# Altium project higgs.PrjPCB (part 7 of 7)
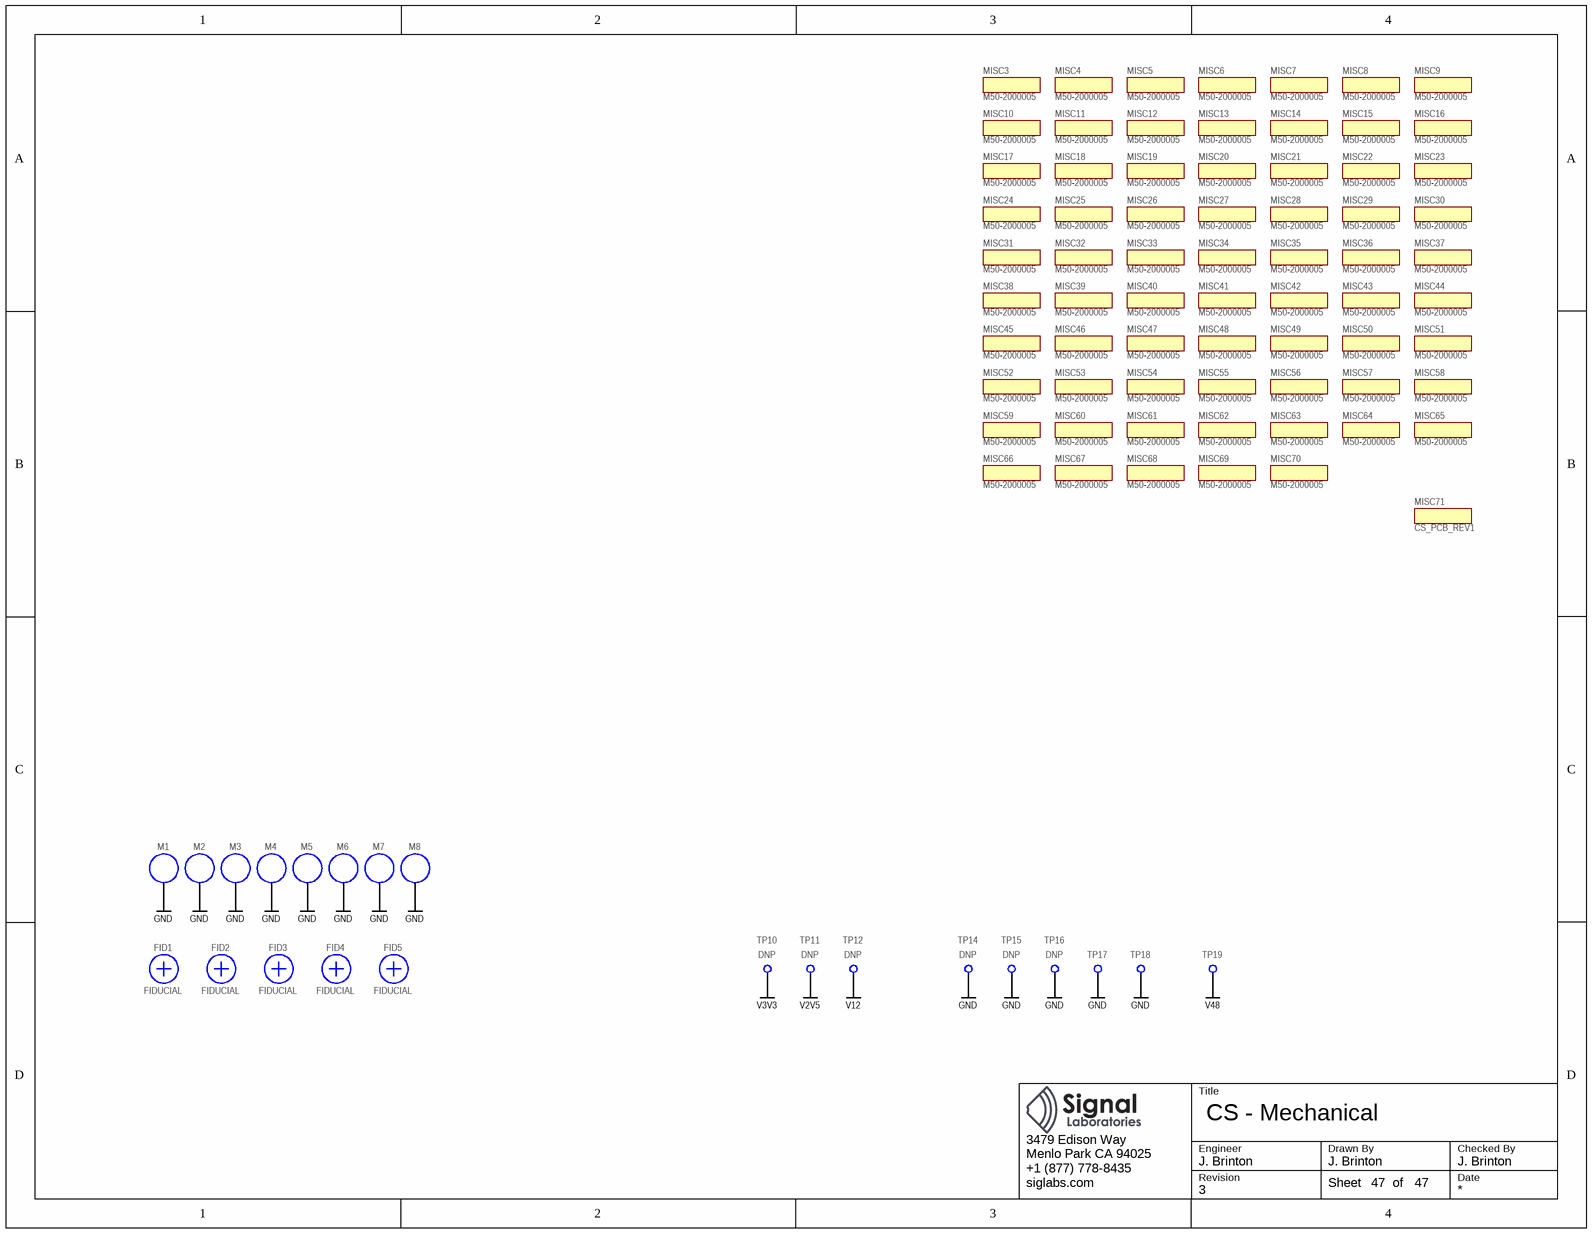
[diagram p49: mechanical.SchDoc]

## Nets that join several sheets
GND: main (R30.1 R124.1), MAIN/ARRAY/FPGA30 (46 pins), MAIN/ARRAY/FPGA30/FPGAGND (226 pins), MAIN/ARRAY/FPGA30/FPGASERDES (41 pins), MAIN/ARRAY/FPGA30/FPGAPOWER (34 pins), MAIN/ARRAY/FPGA31 (46 pins), MAIN/ARRAY/FPGA31/FPGAGND (226 pins), MAIN/ARRAY/FPGA31/FPGASERDES (41 pins), MAIN/ARRAY/FPGA31/FPGAPOWER (34 pins), MAIN/ARRAY/FPGA32 (46 pins), MAIN/ARRAY/FPGA32/FPGAGND (226 pins), MAIN/ARRAY/FPGA32/FPGASERDES (41 pins), MAIN/ARRAY/FPGA32/FPGAPOWER (34 pins), MAIN/ARRAY/FPGA33 (46 pins), MAIN/ARRAY/FPGA33/FPGAGND (226 pins), MAIN/ARRAY/FPGA33/FPGASERDES (41 pins), MAIN/ARRAY/FPGA33/FPGAPOWER (34 pins), MAIN/ARRAY/FPGA20 (46 pins), MAIN/ARRAY/FPGA20/FPGAGND (226 pins), MAIN/ARRAY/FPGA20/FPGASERDES (41 pins), MAIN/ARRAY/FPGA20/FPGAPOWER (34 pins), MAIN/ARRAY/FPGA21 (46 pins), MAIN/ARRAY/FPGA21/FPGAGND (226 pins), MAIN/ARRAY/FPGA21/FPGASERDES (41 pins), MAIN/ARRAY/FPGA21/FPGAPOWER (34 pins), MAIN/ARRAY/FPGA22 (46 pins), MAIN/ARRAY/FPGA22/FPGAGND (226 pins), MAIN/ARRAY/FPGA22/FPGASERDES (41 pins), MAIN/ARRAY/FPGA22/FPGAPOWER (34 pins), MAIN/ARRAY/FPGA23 (46 pins), MAIN/ARRAY/FPGA23/FPGAGND (226 pins), MAIN/ARRAY/FPGA23/FPGASERDES (41 pins), MAIN/ARRAY/FPGA23/FPGAPOWER (34 pins), MAIN/ARRAY/SDRAM33 (7 pins), MAIN/ARRAY/SDRAM33/SDRAMU (38 pins), MAIN/ARRAY/SDRAM33/SDRAML (38 pins), MAIN/ARRAY/SDRAM32 (7 pins), MAIN/ARRAY/SDRAM32/SDRAMU (38 pins), MAIN/ARRAY/SDRAM32/SDRAML (38 pins), MAIN/ARRAY/SDRAM31 (7 pins), MAIN/ARRAY/SDRAM31/SDRAMU (38 pins), MAIN/ARRAY/SDRAM31/SDRAML (38 pins), MAIN/ARRAY/SDRAM30 (7 pins), MAIN/ARRAY/SDRAM30/SDRAMU (38 pins), MAIN/ARRAY/SDRAM30/SDRAML (38 pins), clock (45 pins), reset (8 pins), power-v3v3 (15 pins), power-v1v35 (13 pins), power-vtt (12 pins), power-v5 (9 pins), power-v2v5 (19 pins), som (84 pins), con-som (43 pins), cellular (66 pins), radio-power (38 pins), radio-rf (5 pins), tx (30 pins), MAIN/U_radio/U_radio-rf/TX/U_pa-2g (15 pins), MAIN/U_radio/U_radio-rf/TX/U_pa-5g (15 pins), MAIN/U_radio/U_radio-rf/TX/U_pa-2g (15 pins), MAIN/U_radio/U_radio-rf/TX/U_pa-5g (15 pins), rx (24 pins), mechanical (13 pins)
V1V35: main (NT5.A), reset (R57.2), power-v1v35 (R34.2), power-vtt (C77.2 C78.2 R31.1 U8.2)
V2V5: MAIN/ARRAY/FPGA30/FPGAPOWER (12 pins), MAIN/ARRAY/FPGA31/FPGAPOWER (12 pins), MAIN/ARRAY/FPGA32/FPGAPOWER (12 pins), MAIN/ARRAY/FPGA33/FPGAPOWER (12 pins), MAIN/ARRAY/FPGA20/FPGAPOWER (12 pins), MAIN/ARRAY/FPGA21/FPGAPOWER (12 pins), MAIN/ARRAY/FPGA22/FPGAPOWER (12 pins), MAIN/ARRAY/FPGA23/FPGAPOWER (12 pins), power-v2v5 (5 pins), mechanical (TP11.1)
V3V3: main (R29.2 R123.2), MAIN/ARRAY/FPGA30 (9 pins), MAIN/ARRAY/FPGA30/FPGAPOWER (5 pins), MAIN/ARRAY/FPGA31 (9 pins), MAIN/ARRAY/FPGA31/FPGAPOWER (5 pins), MAIN/ARRAY/FPGA32 (9 pins), MAIN/ARRAY/FPGA32/FPGAPOWER (5 pins), MAIN/ARRAY/FPGA33 (9 pins), MAIN/ARRAY/FPGA33/FPGAPOWER (5 pins), MAIN/ARRAY/FPGA20 (9 pins), MAIN/ARRAY/FPGA20/FPGAPOWER (5 pins), MAIN/ARRAY/FPGA21 (9 pins), MAIN/ARRAY/FPGA21/FPGAPOWER (5 pins), MAIN/ARRAY/FPGA22 (9 pins), MAIN/ARRAY/FPGA22/FPGAPOWER (5 pins), MAIN/ARRAY/FPGA23 (9 pins), MAIN/ARRAY/FPGA23/FPGAPOWER (5 pins), clock (L2.2 L3.2 U3.9), reset (C131.1 R56.2 R58.2 U15.6), power-v3v3 (6 pins), power-v1v35 (C84.2 U9.3 U9.6 U9.7), power-vtt (C83.2 U8.7 U8.10), power-v5 (C158.2 U21.3 U21.6 U21.7), power-v2v5 (C161.2 U23.3 U23.6 U23.7), con-som (R1000.2 R1001.2 U1000.5), cellular (13 pins), tx (C192.2 C193.2 U19.1 U20.1), mechanical (TP10.1)
V5: main (F4.1), power-v3v3 (R46.2), power-vtt (R33.2), power-v5 (R109.2 U21.1), power-v2v5 (R115.2), som (20 pins), con-som (8 pins), cellular (U1004.1 U1004.3 U1004.4), MAIN/U_radio/U_radio-rf/TX/U_pa-2g (7 pins), MAIN/U_radio/U_radio-rf/TX/U_pa-5g (8 pins), MAIN/U_radio/U_radio-rf/TX/U_pa-2g (7 pins), MAIN/U_radio/U_radio-rf/TX/U_pa-5g (8 pins)
V12: MAIN/ARRAY/FPGA30/FPGAPOWER (C9A.2 U7A.10 U7A.11 U7A.12), MAIN/ARRAY/FPGA31/FPGAPOWER (C9B.2 U7B.10 U7B.11 U7B.12), MAIN/ARRAY/FPGA32/FPGAPOWER (C9C.2 U7C.10 U7C.11 U7C.12), MAIN/ARRAY/FPGA33/FPGAPOWER (C9D.2 U7D.10 U7D.11 U7D.12), MAIN/ARRAY/FPGA20/FPGAPOWER (C9E.2 U7E.10 U7E.11 U7E.12), MAIN/ARRAY/FPGA21/FPGAPOWER (C9F.2 U7F.10 U7F.11 U7F.12), MAIN/ARRAY/FPGA22/FPGAPOWER (C9G.2 U7G.10 U7G.11 U7G.12), MAIN/ARRAY/FPGA23/FPGAPOWER (C9H.2 U7H.10 U7H.11 U7H.12), power-v3v3 (5 pins), power-v1v35 (10 pins), power-v5 (C160.2 U22.2 U22.3), power-v2v5 (5 pins), mechanical (TP12.1)
VCC3P3_SYS: som (U1003.PAK17 U1003.PAK18 U1003.PAL17 U1003.PAL18), con-som (5 pins)
A.VIOLR_FPGA20: MAIN/ARRAY/FPGA20 (C54E.2 C55E.2 C56E.2 C57E.2), MAIN/ARRAY/FPGA20/FPGA2B (U1E#3.M23 U1E#3.P23 U1E#3.R23 U1E#3.T23)
A.VIOLR_FPGA20: MAIN/ARRAY/FPGA20 (C22E.2 C23E.2 C24E.2 C25E.2), MAIN/ARRAY/FPGA20/FPGA3B (U1E#4.AA23 U1E#4.U23 U1E#4.V23 U1E#4.W23)
A.VIOLR_FPGA21: MAIN/ARRAY/FPGA21 (C54F.2 C55F.2 C56F.2 C57F.2), MAIN/ARRAY/FPGA21/FPGA2B (U1F#3.M23 U1F#3.P23 U1F#3.R23 U1F#3.T23)
A.VIOLR_FPGA21: MAIN/ARRAY/FPGA21 (C22F.2 C23F.2 C24F.2 C25F.2), MAIN/ARRAY/FPGA21/FPGA3B (U1F#4.AA23 U1F#4.U23 U1F#4.V23 U1F#4.W23)
A.VIOLR_FPGA22: MAIN/ARRAY/FPGA22 (C54G.2 C55G.2 C56G.2 C57G.2), MAIN/ARRAY/FPGA22/FPGA2B (U1G#3.M23 U1G#3.P23 U1G#3.R23 U1G#3.T23)
A.VIOLR_FPGA22: MAIN/ARRAY/FPGA22 (C22G.2 C23G.2 C24G.2 C25G.2), MAIN/ARRAY/FPGA22/FPGA3B (U1G#4.AA23 U1G#4.U23 U1G#4.V23 U1G#4.W23)
A.VIOLR_FPGA23: MAIN/ARRAY/FPGA23 (C22H.2 C23H.2 C24H.2 C25H.2), MAIN/ARRAY/FPGA23/FPGA3B (U1H#4.AA23 U1H#4.U23 U1H#4.V23 U1H#4.W23)
A.VIOLR_FPGA30: MAIN/ARRAY/FPGA30 (C54A.2 C55A.2 C56A.2 C57A.2), MAIN/ARRAY/FPGA30/FPGA2B (U1A#3.M23 U1A#3.P23 U1A#3.R23 U1A#3.T23)
A.VIOLR_FPGA31: MAIN/ARRAY/FPGA31 (C54B.2 C55B.2 C56B.2 C57B.2), MAIN/ARRAY/FPGA31/FPGA2B (U1B#3.M23 U1B#3.P23 U1B#3.R23 U1B#3.T23)
A.VIOLR_FPGA32: MAIN/ARRAY/FPGA32 (C54C.2 C55C.2 C56C.2 C57C.2), MAIN/ARRAY/FPGA32/FPGA2B (U1C#3.M23 U1C#3.P23 U1C#3.R23 U1C#3.T23)
A.VIOTB_FPGA20: MAIN/ARRAY/FPGA20 (C50E.2 C51E.2 C52E.2 C53E.2), MAIN/ARRAY/FPGA20/FPGA1B (U1E#2.K17 U1E#2.K18 U1E#2.K19 U1E#2.K21)
A.VIOTB_FPGA20: MAIN/ARRAY/FPGA20 (C28E.2 C29E.2 C30E.2), MAIN/ARRAY/FPGA20/FPGA4B (U1E#5.AB23 U1E#5.AC23)
A.VIOTB_FPGA21: MAIN/ARRAY/FPGA21 (C50F.2 C51F.2 C52F.2 C53F.2), MAIN/ARRAY/FPGA21/FPGA1B (U1F#2.K17 U1F#2.K18 U1F#2.K19 U1F#2.K21)
A.VIOTB_FPGA21: MAIN/ARRAY/FPGA21 (C28F.2 C29F.2 C30F.2), MAIN/ARRAY/FPGA21/FPGA4B (U1F#5.AB23 U1F#5.AC23)
A.VIOTB_FPGA22: MAIN/ARRAY/FPGA22 (C50G.2 C51G.2 C52G.2 C53G.2), MAIN/ARRAY/FPGA22/FPGA1B (U1G#2.K17 U1G#2.K18 U1G#2.K19 U1G#2.K21)
A.VIOTB_FPGA22: MAIN/ARRAY/FPGA22 (C28G.2 C29G.2 C30G.2), MAIN/ARRAY/FPGA22/FPGA4B (U1G#5.AB23 U1G#5.AC23)
A.VIOTB_FPGA23: MAIN/ARRAY/FPGA23 (C28H.2 C29H.2 C30H.2), MAIN/ARRAY/FPGA23/FPGA4B (U1H#5.AB23 U1H#5.AC23)
A.VIOTB_FPGA30: MAIN/ARRAY/FPGA30 (C50A.2 C51A.2 C52A.2 C53A.2), MAIN/ARRAY/FPGA30/FPGA1B (U1A#2.K17 U1A#2.K18 U1A#2.K19 U1A#2.K21)
A.VIOTB_FPGA31: MAIN/ARRAY/FPGA31 (C50B.2 C51B.2 C52B.2 C53B.2), MAIN/ARRAY/FPGA31/FPGA1B (U1B#2.K17 U1B#2.K18 U1B#2.K19 U1B#2.K21)
A.VIOTB_FPGA32: MAIN/ARRAY/FPGA32 (C50C.2 C51C.2 C52C.2 C53C.2), MAIN/ARRAY/FPGA32/FPGA1B (U1C#2.K17 U1C#2.K18 U1C#2.K19 U1C#2.K21)
B.VIOLR_FPGA21: MAIN/ARRAY/FPGA21 (C33F.2 C34F.2 C35F.2 C36F.2), MAIN/ARRAY/FPGA21/FPGA6B (U1F#6.AA10 U1F#6.U10 U1F#6.V10 U1F#6.W10)
B.VIOLR_FPGA22: MAIN/ARRAY/FPGA22 (C33G.2 C34G.2 C35G.2 C36G.2), MAIN/ARRAY/FPGA22/FPGA6B (U1G#6.AA10 U1G#6.U10 U1G#6.V10 U1G#6.W10)
B.VIOLR_FPGA23: MAIN/ARRAY/FPGA23 (C33H.2 C34H.2 C35H.2 C36H.2), MAIN/ARRAY/FPGA23/FPGA6B (U1H#6.AA10 U1H#6.U10 U1H#6.V10 U1H#6.W10)
B.VIOLR_FPGA30: MAIN/ARRAY/FPGA30 (C15A.2 C16A.2 C17A.2 C18A.2), MAIN/ARRAY/FPGA30/FPGA7B (U1A#7.M10 U1A#7.P10 U1A#7.R10 U1A#7.T10)
B.VIOLR_FPGA31: MAIN/ARRAY/FPGA31 (C33B.2 C34B.2 C35B.2 C36B.2), MAIN/ARRAY/FPGA31/FPGA6B (U1B#6.AA10 U1B#6.U10 U1B#6.V10 U1B#6.W10)
B.VIOLR_FPGA31: MAIN/ARRAY/FPGA31 (C15B.2 C16B.2 C17B.2 C18B.2), MAIN/ARRAY/FPGA31/FPGA7B (U1B#7.M10 U1B#7.P10 U1B#7.R10 U1B#7.T10)
B.VIOLR_FPGA32: MAIN/ARRAY/FPGA32 (C33C.2 C34C.2 C35C.2 C36C.2), MAIN/ARRAY/FPGA32/FPGA6B (U1C#6.AA10 U1C#6.U10 U1C#6.V10 U1C#6.W10)
B.VIOLR_FPGA32: MAIN/ARRAY/FPGA32 (C15C.2 C16C.2 C17C.2 C18C.2), MAIN/ARRAY/FPGA32/FPGA7B (U1C#7.M10 U1C#7.P10 U1C#7.R10 U1C#7.T10)
B.VIOLR_FPGA33: MAIN/ARRAY/FPGA33 (C33D.2 C34D.2 C35D.2 C36D.2), MAIN/ARRAY/FPGA33/FPGA6B (U1D#6.AA10 U1D#6.U10 U1D#6.V10 U1D#6.W10)
B.VIOLR_FPGA33: MAIN/ARRAY/FPGA33 (C15D.2 C16D.2 C17D.2 C18D.2), MAIN/ARRAY/FPGA33/FPGA7B (U1D#7.M10 U1D#7.P10 U1D#7.R10 U1D#7.T10)
B.VIOTB_FPGA21: MAIN/ARRAY/FPGA21 (C31F.2 C32F.2 R4F.2 U6F.13), MAIN/ARRAY/FPGA21/FPGA8B (R1F.2 U1F#8.AB10 U1F#8.AC10)
B.VIOTB_FPGA22: MAIN/ARRAY/FPGA22 (C31G.2 C32G.2 R4G.2 U6G.13), MAIN/ARRAY/FPGA22/FPGA8B (R1G.2 U1G#8.AB10 U1G#8.AC10)
B.VIOTB_FPGA23: MAIN/ARRAY/FPGA23 (C31H.2 C32H.2 R4H.2 U6H.13), MAIN/ARRAY/FPGA23/FPGA8B (R1H.2 U1H#8.AB10 U1H#8.AC10)
B.VIOTB_FPGA30: MAIN/ARRAY/FPGA30 (C46A.2 C47A.2 C48A.2 C49A.2), MAIN/ARRAY/FPGA30/FPGA0B (U1A#1.K12 U1A#1.K14 U1A#1.K15 U1A#1.K16)
B.VIOTB_FPGA31: MAIN/ARRAY/FPGA31 (C31B.2 C32B.2 R4B.2 U6B.13), MAIN/ARRAY/FPGA31/FPGA8B (R1B.2 U1B#8.AB10 U1B#8.AC10)
B.VIOTB_FPGA31: MAIN/ARRAY/FPGA31 (C46B.2 C47B.2 C48B.2 C49B.2), MAIN/ARRAY/FPGA31/FPGA0B (U1B#1.K12 U1B#1.K14 U1B#1.K15 U1B#1.K16)
B.VIOTB_FPGA32: MAIN/ARRAY/FPGA32 (C31C.2 C32C.2 R4C.2 U6C.13), MAIN/ARRAY/FPGA32/FPGA8B (R1C.2 U1C#8.AB10 U1C#8.AC10)
B.VIOTB_FPGA32: MAIN/ARRAY/FPGA32 (C46C.2 C47C.2 C48C.2 C49C.2), MAIN/ARRAY/FPGA32/FPGA0B (U1C#1.K12 U1C#1.K14 U1C#1.K15 U1C#1.K16)
B.VIOTB_FPGA33: MAIN/ARRAY/FPGA33 (C31D.2 C32D.2 R4D.2 U6D.13), MAIN/ARRAY/FPGA33/FPGA8B (R1D.2 U1D#8.AB10 U1D#8.AC10)
B.VIOTB_FPGA33: MAIN/ARRAY/FPGA33 (C46D.2 C47D.2 C48D.2 C49D.2), MAIN/ARRAY/FPGA33/FPGA0B (U1D#1.K12 U1D#1.K14 U1D#1.K15 U1D#1.K16)
CLK.C_N: MAIN/ARRAY/FPGA30 (C7A.2), clock (R13.4 U3.52)
CLK.C_N: MAIN/ARRAY/FPGA31 (C7B.2), clock (R13.2 U3.54)
CLK.C_N: MAIN/ARRAY/FPGA32 (C7C.2), clock (R12.8 U3.56)
CLK.C_N: MAIN/ARRAY/FPGA33 (C7D.2), clock (R13.8 U3.46)
CLK.C_N: MAIN/ARRAY/FPGA20 (C7E.2), clock (R12.6 U3.59)
CLK.C_N: MAIN/ARRAY/FPGA21 (C7F.2), clock (R12.4 U3.42 U3.61)
CLK.C_N: MAIN/ARRAY/FPGA22 (C7G.2), clock (R12.2 U3.38 U3.63)
CLK.C_N: MAIN/ARRAY/FPGA23 (C7H.2), clock (R16.2 U3.36 U3.44)
CLK.C_P: MAIN/ARRAY/FPGA30 (C6A.2), clock (R13.3 U3.53)
CLK.C_P: MAIN/ARRAY/FPGA31 (C6B.2), clock (R13.1 U3.55)
CLK.C_P: MAIN/ARRAY/FPGA32 (C6C.2), clock (R12.7 U3.57)
CLK.C_P: MAIN/ARRAY/FPGA33 (C6D.2), clock (R13.7 U3.47)
CLK.C_P: MAIN/ARRAY/FPGA20 (C6E.2), clock (R12.5 U3.60)
CLK.C_P: MAIN/ARRAY/FPGA21 (C6F.2), clock (R12.3 U3.43 U3.62)
CLK.C_P: MAIN/ARRAY/FPGA22 (C6G.2), clock (R12.1 U3.39 U3.64)
CLK.C_P: MAIN/ARRAY/FPGA23 (C6H.2), clock (R16.1 U3.37 U3.45)
DA/C.CTRL.CASN: MAIN/ARRAY/SDRAM33/SDRAMU (U14A.K3), MAIN/ARRAY/SDRAM33/SDRAML (U14B.K3)
DA/C.CTRL.CASN: MAIN/ARRAY/SDRAM32/SDRAMU (U14C.K3), MAIN/ARRAY/SDRAM32/SDRAML (U14D.K3)
DA/C.CTRL.CASN: MAIN/ARRAY/SDRAM31/SDRAMU (U14E.K3), MAIN/ARRAY/SDRAM31/SDRAML (U14F.K3)
DA/C.CTRL.CASN: MAIN/ARRAY/SDRAM30/SDRAMU (U14G.K3), MAIN/ARRAY/SDRAM30/SDRAML (U14H.K3)
DA/C.CTRL.CKE: MAIN/ARRAY/SDRAM33/SDRAMU (U14A.K9), MAIN/ARRAY/SDRAM33/SDRAML (U14B.K9)
DA/C.CTRL.CKE: MAIN/ARRAY/SDRAM32/SDRAMU (U14C.K9), MAIN/ARRAY/SDRAM32/SDRAML (U14D.K9)
DA/C.CTRL.CKE: MAIN/ARRAY/SDRAM31/SDRAMU (U14E.K9), MAIN/ARRAY/SDRAM31/SDRAML (U14F.K9)
DA/C.CTRL.CKE: MAIN/ARRAY/SDRAM30/SDRAMU (U14G.K9), MAIN/ARRAY/SDRAM30/SDRAML (U14H.K9)
DA/C.CTRL.CLK_N: MAIN/ARRAY/SDRAM33/SDRAMU (U14A.K7), MAIN/ARRAY/SDRAM33/SDRAML (U14B.K7)
DA/C.CTRL.CLK_N: MAIN/ARRAY/SDRAM32/SDRAMU (U14C.K7), MAIN/ARRAY/SDRAM32/SDRAML (U14D.K7)
DA/C.CTRL.CLK_N: MAIN/ARRAY/SDRAM31/SDRAMU (U14E.K7), MAIN/ARRAY/SDRAM31/SDRAML (U14F.K7)
DA/C.CTRL.CLK_N: MAIN/ARRAY/SDRAM30/SDRAMU (U14G.K7), MAIN/ARRAY/SDRAM30/SDRAML (U14H.K7)
DA/C.CTRL.CLK_P: MAIN/ARRAY/SDRAM33/SDRAMU (U14A.J7), MAIN/ARRAY/SDRAM33/SDRAML (U14B.J7)
DA/C.CTRL.CLK_P: MAIN/ARRAY/SDRAM32/SDRAMU (U14C.J7), MAIN/ARRAY/SDRAM32/SDRAML (U14D.J7)
DA/C.CTRL.CLK_P: MAIN/ARRAY/SDRAM31/SDRAMU (U14E.J7), MAIN/ARRAY/SDRAM31/SDRAML (U14F.J7)
DA/C.CTRL.CLK_P: MAIN/ARRAY/SDRAM30/SDRAMU (U14G.J7), MAIN/ARRAY/SDRAM30/SDRAML (U14H.J7)
DA/C.CTRL.CSN: MAIN/ARRAY/SDRAM33/SDRAMU (U14A.L2), MAIN/ARRAY/SDRAM33/SDRAML (U14B.L2)
DA/C.CTRL.CSN: MAIN/ARRAY/SDRAM32/SDRAMU (U14C.L2), MAIN/ARRAY/SDRAM32/SDRAML (U14D.L2)
DA/C.CTRL.CSN: MAIN/ARRAY/SDRAM31/SDRAMU (U14E.L2), MAIN/ARRAY/SDRAM31/SDRAML (U14F.L2)
DA/C.CTRL.CSN: MAIN/ARRAY/SDRAM30/SDRAMU (U14G.L2), MAIN/ARRAY/SDRAM30/SDRAML (U14H.L2)
DA/C.CTRL.ODT: MAIN/ARRAY/SDRAM33/SDRAMU (U14A.K1), MAIN/ARRAY/SDRAM33/SDRAML (U14B.K1)
DA/C.CTRL.ODT: MAIN/ARRAY/SDRAM32/SDRAMU (U14C.K1), MAIN/ARRAY/SDRAM32/SDRAML (U14D.K1)
DA/C.CTRL.ODT: MAIN/ARRAY/SDRAM31/SDRAMU (U14E.K1), MAIN/ARRAY/SDRAM31/SDRAML (U14F.K1)
DA/C.CTRL.ODT: MAIN/ARRAY/SDRAM30/SDRAMU (U14G.K1), MAIN/ARRAY/SDRAM30/SDRAML (U14H.K1)
DA/C.CTRL.RASN: MAIN/ARRAY/SDRAM33/SDRAMU (U14A.J3), MAIN/ARRAY/SDRAM33/SDRAML (U14B.J3)
DA/C.CTRL.RASN: MAIN/ARRAY/SDRAM32/SDRAMU (U14C.J3), MAIN/ARRAY/SDRAM32/SDRAML (U14D.J3)
DA/C.CTRL.RASN: MAIN/ARRAY/SDRAM31/SDRAMU (U14E.J3), MAIN/ARRAY/SDRAM31/SDRAML (U14F.J3)
DA/C.CTRL.RASN: MAIN/ARRAY/SDRAM30/SDRAMU (U14G.J3), MAIN/ARRAY/SDRAM30/SDRAML (U14H.J3)
DA/C.CTRL.RSTN: MAIN/ARRAY/SDRAM33/SDRAMU (U14A.T2), MAIN/ARRAY/SDRAM33/SDRAML (U14B.T2)
DA/C.CTRL.RSTN: MAIN/ARRAY/SDRAM32/SDRAMU (U14C.T2), MAIN/ARRAY/SDRAM32/SDRAML (U14D.T2)
DA/C.CTRL.RSTN: MAIN/ARRAY/SDRAM31/SDRAMU (U14E.T2), MAIN/ARRAY/SDRAM31/SDRAML (U14F.T2)
DA/C.CTRL.RSTN: MAIN/ARRAY/SDRAM30/SDRAMU (U14G.T2), MAIN/ARRAY/SDRAM30/SDRAML (U14H.T2)
DA/C.CTRL.WEN: MAIN/ARRAY/SDRAM33/SDRAMU (U14A.L3), MAIN/ARRAY/SDRAM33/SDRAML (U14B.L3)
DA/C.CTRL.WEN: MAIN/ARRAY/SDRAM32/SDRAMU (U14C.L3), MAIN/ARRAY/SDRAM32/SDRAML (U14D.L3)
DA/C.CTRL.WEN: MAIN/ARRAY/SDRAM31/SDRAMU (U14E.L3), MAIN/ARRAY/SDRAM31/SDRAML (U14F.L3)
DA/C.CTRL.WEN: MAIN/ARRAY/SDRAM30/SDRAMU (U14G.L3), MAIN/ARRAY/SDRAM30/SDRAML (U14H.L3)
DA/C.DA/B.A0: MAIN/ARRAY/SDRAM33/SDRAMU (U14A.N3), MAIN/ARRAY/SDRAM33/SDRAML (U14B.N3)
DA/C.DA/B.A0: MAIN/ARRAY/SDRAM32/SDRAMU (U14C.N3), MAIN/ARRAY/SDRAM32/SDRAML (U14D.N3)
DA/C.DA/B.A0: MAIN/ARRAY/SDRAM31/SDRAMU (U14E.N3), MAIN/ARRAY/SDRAM31/SDRAML (U14F.N3)
DA/C.DA/B.A0: MAIN/ARRAY/SDRAM30/SDRAMU (U14G.N3), MAIN/ARRAY/SDRAM30/SDRAML (U14H.N3)
DA/C.DA/B.A1: MAIN/ARRAY/SDRAM33/SDRAMU (U14A.P7), MAIN/ARRAY/SDRAM33/SDRAML (U14B.P7)
DA/C.DA/B.A1: MAIN/ARRAY/SDRAM32/SDRAMU (U14C.P7), MAIN/ARRAY/SDRAM32/SDRAML (U14D.P7)
DA/C.DA/B.A1: MAIN/ARRAY/SDRAM31/SDRAMU (U14E.P7), MAIN/ARRAY/SDRAM31/SDRAML (U14F.P7)
DA/C.DA/B.A1: MAIN/ARRAY/SDRAM30/SDRAMU (U14G.P7), MAIN/ARRAY/SDRAM30/SDRAML (U14H.P7)
DA/C.DA/B.A2: MAIN/ARRAY/SDRAM33/SDRAMU (U14A.P3), MAIN/ARRAY/SDRAM33/SDRAML (U14B.P3)
DA/C.DA/B.A2: MAIN/ARRAY/SDRAM32/SDRAMU (U14C.P3), MAIN/ARRAY/SDRAM32/SDRAML (U14D.P3)
DA/C.DA/B.A2: MAIN/ARRAY/SDRAM31/SDRAMU (U14E.P3), MAIN/ARRAY/SDRAM31/SDRAML (U14F.P3)
DA/C.DA/B.A2: MAIN/ARRAY/SDRAM30/SDRAMU (U14G.P3), MAIN/ARRAY/SDRAM30/SDRAML (U14H.P3)
DA/C.DA/B.A3: MAIN/ARRAY/SDRAM33/SDRAMU (U14A.N2), MAIN/ARRAY/SDRAM33/SDRAML (U14B.N2)
DA/C.DA/B.A3: MAIN/ARRAY/SDRAM32/SDRAMU (U14C.N2), MAIN/ARRAY/SDRAM32/SDRAML (U14D.N2)
DA/C.DA/B.A3: MAIN/ARRAY/SDRAM31/SDRAMU (U14E.N2), MAIN/ARRAY/SDRAM31/SDRAML (U14F.N2)
DA/C.DA/B.A3: MAIN/ARRAY/SDRAM30/SDRAMU (U14G.N2), MAIN/ARRAY/SDRAM30/SDRAML (U14H.N2)
DA/C.DA/B.A4: MAIN/ARRAY/SDRAM33/SDRAMU (U14A.P8), MAIN/ARRAY/SDRAM33/SDRAML (U14B.P8)
DA/C.DA/B.A4: MAIN/ARRAY/SDRAM32/SDRAMU (U14C.P8), MAIN/ARRAY/SDRAM32/SDRAML (U14D.P8)
DA/C.DA/B.A4: MAIN/ARRAY/SDRAM31/SDRAMU (U14E.P8), MAIN/ARRAY/SDRAM31/SDRAML (U14F.P8)
DA/C.DA/B.A4: MAIN/ARRAY/SDRAM30/SDRAMU (U14G.P8), MAIN/ARRAY/SDRAM30/SDRAML (U14H.P8)
DA/C.DA/B.A5: MAIN/ARRAY/SDRAM33/SDRAMU (U14A.P2), MAIN/ARRAY/SDRAM33/SDRAML (U14B.P2)
DA/C.DA/B.A5: MAIN/ARRAY/SDRAM32/SDRAMU (U14C.P2), MAIN/ARRAY/SDRAM32/SDRAML (U14D.P2)
DA/C.DA/B.A5: MAIN/ARRAY/SDRAM31/SDRAMU (U14E.P2), MAIN/ARRAY/SDRAM31/SDRAML (U14F.P2)
DA/C.DA/B.A5: MAIN/ARRAY/SDRAM30/SDRAMU (U14G.P2), MAIN/ARRAY/SDRAM30/SDRAML (U14H.P2)
DA/C.DA/B.A6: MAIN/ARRAY/SDRAM33/SDRAMU (U14A.R8), MAIN/ARRAY/SDRAM33/SDRAML (U14B.R8)
DA/C.DA/B.A6: MAIN/ARRAY/SDRAM32/SDRAMU (U14C.R8), MAIN/ARRAY/SDRAM32/SDRAML (U14D.R8)
DA/C.DA/B.A6: MAIN/ARRAY/SDRAM31/SDRAMU (U14E.R8), MAIN/ARRAY/SDRAM31/SDRAML (U14F.R8)
DA/C.DA/B.A6: MAIN/ARRAY/SDRAM30/SDRAMU (U14G.R8), MAIN/ARRAY/SDRAM30/SDRAML (U14H.R8)
DA/C.DA/B.A7: MAIN/ARRAY/SDRAM33/SDRAMU (U14A.R2), MAIN/ARRAY/SDRAM33/SDRAML (U14B.R2)
DA/C.DA/B.A7: MAIN/ARRAY/SDRAM32/SDRAMU (U14C.R2), MAIN/ARRAY/SDRAM32/SDRAML (U14D.R2)
DA/C.DA/B.A7: MAIN/ARRAY/SDRAM31/SDRAMU (U14E.R2), MAIN/ARRAY/SDRAM31/SDRAML (U14F.R2)
DA/C.DA/B.A7: MAIN/ARRAY/SDRAM30/SDRAMU (U14G.R2), MAIN/ARRAY/SDRAM30/SDRAML (U14H.R2)
DA/C.DA/B.A8: MAIN/ARRAY/SDRAM33/SDRAMU (U14A.T8), MAIN/ARRAY/SDRAM33/SDRAML (U14B.T8)
DA/C.DA/B.A8: MAIN/ARRAY/SDRAM32/SDRAMU (U14C.T8), MAIN/ARRAY/SDRAM32/SDRAML (U14D.T8)
DA/C.DA/B.A8: MAIN/ARRAY/SDRAM31/SDRAMU (U14E.T8), MAIN/ARRAY/SDRAM31/SDRAML (U14F.T8)
DA/C.DA/B.A8: MAIN/ARRAY/SDRAM30/SDRAMU (U14G.T8), MAIN/ARRAY/SDRAM30/SDRAML (U14H.T8)
DA/C.DA/B.A9: MAIN/ARRAY/SDRAM33/SDRAMU (U14A.R3), MAIN/ARRAY/SDRAM33/SDRAML (U14B.R3)
DA/C.DA/B.A9: MAIN/ARRAY/SDRAM32/SDRAMU (U14C.R3), MAIN/ARRAY/SDRAM32/SDRAML (U14D.R3)
DA/C.DA/B.A9: MAIN/ARRAY/SDRAM31/SDRAMU (U14E.R3), MAIN/ARRAY/SDRAM31/SDRAML (U14F.R3)
DA/C.DA/B.A9: MAIN/ARRAY/SDRAM30/SDRAMU (U14G.R3), MAIN/ARRAY/SDRAM30/SDRAML (U14H.R3)
DA/C.DA/B.A10: MAIN/ARRAY/SDRAM33/SDRAMU (U14A.L7), MAIN/ARRAY/SDRAM33/SDRAML (U14B.L7)
DA/C.DA/B.A10: MAIN/ARRAY/SDRAM32/SDRAMU (U14C.L7), MAIN/ARRAY/SDRAM32/SDRAML (U14D.L7)
DA/C.DA/B.A10: MAIN/ARRAY/SDRAM31/SDRAMU (U14E.L7), MAIN/ARRAY/SDRAM31/SDRAML (U14F.L7)
DA/C.DA/B.A10: MAIN/ARRAY/SDRAM30/SDRAMU (U14G.L7), MAIN/ARRAY/SDRAM30/SDRAML (U14H.L7)
DA/C.DA/B.A11: MAIN/ARRAY/SDRAM33/SDRAMU (U14A.R7), MAIN/ARRAY/SDRAM33/SDRAML (U14B.R7)
DA/C.DA/B.A11: MAIN/ARRAY/SDRAM32/SDRAMU (U14C.R7), MAIN/ARRAY/SDRAM32/SDRAML (U14D.R7)
DA/C.DA/B.A11: MAIN/ARRAY/SDRAM31/SDRAMU (U14E.R7), MAIN/ARRAY/SDRAM31/SDRAML (U14F.R7)
DA/C.DA/B.A11: MAIN/ARRAY/SDRAM30/SDRAMU (U14G.R7), MAIN/ARRAY/SDRAM30/SDRAML (U14H.R7)
DA/C.DA/B.A12: MAIN/ARRAY/SDRAM33/SDRAMU (U14A.N7), MAIN/ARRAY/SDRAM33/SDRAML (U14B.N7)
DA/C.DA/B.A12: MAIN/ARRAY/SDRAM32/SDRAMU (U14C.N7), MAIN/ARRAY/SDRAM32/SDRAML (U14D.N7)
DA/C.DA/B.A12: MAIN/ARRAY/SDRAM31/SDRAMU (U14E.N7), MAIN/ARRAY/SDRAM31/SDRAML (U14F.N7)
DA/C.DA/B.A12: MAIN/ARRAY/SDRAM30/SDRAMU (U14G.N7), MAIN/ARRAY/SDRAM30/SDRAML (U14H.N7)
DA/C.DA/B.A13: MAIN/ARRAY/SDRAM33/SDRAMU (U14A.T3), MAIN/ARRAY/SDRAM33/SDRAML (U14B.T3)
DA/C.DA/B.A13: MAIN/ARRAY/SDRAM32/SDRAMU (U14C.T3), MAIN/ARRAY/SDRAM32/SDRAML (U14D.T3)
DA/C.DA/B.A13: MAIN/ARRAY/SDRAM31/SDRAMU (U14E.T3), MAIN/ARRAY/SDRAM31/SDRAML (U14F.T3)
DA/C.DA/B.A13: MAIN/ARRAY/SDRAM30/SDRAMU (U14G.T3), MAIN/ARRAY/SDRAM30/SDRAML (U14H.T3)
DA/C.DA/B.A14: MAIN/ARRAY/SDRAM33/SDRAMU (U14A.T7), MAIN/ARRAY/SDRAM33/SDRAML (U14B.T7)
DA/C.DA/B.A14: MAIN/ARRAY/SDRAM32/SDRAMU (U14C.T7), MAIN/ARRAY/SDRAM32/SDRAML (U14D.T7)
DA/C.DA/B.A14: MAIN/ARRAY/SDRAM31/SDRAMU (U14E.T7), MAIN/ARRAY/SDRAM31/SDRAML (U14F.T7)
DA/C.DA/B.A14: MAIN/ARRAY/SDRAM30/SDRAMU (U14G.T7), MAIN/ARRAY/SDRAM30/SDRAML (U14H.T7)
DA/C.DA/B.B0: MAIN/ARRAY/SDRAM33/SDRAMU (U14A.M2), MAIN/ARRAY/SDRAM33/SDRAML (U14B.M2)
DA/C.DA/B.B0: MAIN/ARRAY/SDRAM32/SDRAMU (U14C.M2), MAIN/ARRAY/SDRAM32/SDRAML (U14D.M2)
DA/C.DA/B.B0: MAIN/ARRAY/SDRAM31/SDRAMU (U14E.M2), MAIN/ARRAY/SDRAM31/SDRAML (U14F.M2)
DA/C.DA/B.B0: MAIN/ARRAY/SDRAM30/SDRAMU (U14G.M2), MAIN/ARRAY/SDRAM30/SDRAML (U14H.M2)
DA/C.DA/B.B1: MAIN/ARRAY/SDRAM33/SDRAMU (U14A.N8), MAIN/ARRAY/SDRAM33/SDRAML (U14B.N8)
DA/C.DA/B.B1: MAIN/ARRAY/SDRAM32/SDRAMU (U14C.N8), MAIN/ARRAY/SDRAM32/SDRAML (U14D.N8)
DA/C.DA/B.B1: MAIN/ARRAY/SDRAM31/SDRAMU (U14E.N8), MAIN/ARRAY/SDRAM31/SDRAML (U14F.N8)
DA/C.DA/B.B1: MAIN/ARRAY/SDRAM30/SDRAMU (U14G.N8), MAIN/ARRAY/SDRAM30/SDRAML (U14H.N8)
DA/C.DA/B.B2: MAIN/ARRAY/SDRAM33/SDRAMU (U14A.M3), MAIN/ARRAY/SDRAM33/SDRAML (U14B.M3)
DA/C.DA/B.B2: MAIN/ARRAY/SDRAM32/SDRAMU (U14C.M3), MAIN/ARRAY/SDRAM32/SDRAML (U14D.M3)
DA/C.DA/B.B2: MAIN/ARRAY/SDRAM31/SDRAMU (U14E.M3), MAIN/ARRAY/SDRAM31/SDRAML (U14F.M3)
DA/C.DA/B.B2: MAIN/ARRAY/SDRAM30/SDRAMU (U14G.M3), MAIN/ARRAY/SDRAM30/SDRAML (U14H.M3)
FPGA_LED_FPGA20: MAIN/ARRAY/FPGA20 (Q1E.1), MAIN/ARRAY/FPGA20/FPGA0B (U1E#1.A8)
FPGA_LED_FPGA21: MAIN/ARRAY/FPGA21 (Q1F.1), MAIN/ARRAY/FPGA21/FPGA0B (U1F#1.A8)
FPGA_LED_FPGA22: MAIN/ARRAY/FPGA22 (Q1G.1), MAIN/ARRAY/FPGA22/FPGA0B (U1G#1.A8)
FPGA_LED_FPGA23: MAIN/ARRAY/FPGA23 (Q1H.1), MAIN/ARRAY/FPGA23/FPGA0B (U1H#1.A8)
FPGA_LED_FPGA30: MAIN/ARRAY/FPGA30 (Q1A.1), MAIN/ARRAY/FPGA30/FPGA0B (U1A#1.A8)
FPGA_LED_FPGA31: MAIN/ARRAY/FPGA31 (Q1B.1), MAIN/ARRAY/FPGA31/FPGA0B (U1B#1.A8)
FPGA_LED_FPGA32: MAIN/ARRAY/FPGA32 (Q1C.1), MAIN/ARRAY/FPGA32/FPGA0B (U1C#1.A8)
FPGA_LED_FPGA33: MAIN/ARRAY/FPGA33 (Q1D.1), MAIN/ARRAY/FPGA33/FPGA0B (U1D#1.A8)
FPGA_TCK_FPGA20: MAIN/ARRAY/FPGA20 (U6E.10), MAIN/ARRAY/FPGA20/FPGA8B (U1E#8.AK5)
FPGA_TCK_FPGA21: MAIN/ARRAY/FPGA21 (U6F.10), MAIN/ARRAY/FPGA21/FPGA8B (U1F#8.AK5)
FPGA_TCK_FPGA22: MAIN/ARRAY/FPGA22 (U6G.10), MAIN/ARRAY/FPGA22/FPGA8B (U1G#8.AK5)
FPGA_TCK_FPGA23: MAIN/ARRAY/FPGA23 (U6H.10), MAIN/ARRAY/FPGA23/FPGA8B (U1H#8.AK5)
FPGA_TCK_FPGA30: MAIN/ARRAY/FPGA30 (U6A.10), MAIN/ARRAY/FPGA30/FPGA8B (U1A#8.AK5)
FPGA_TCK_FPGA31: MAIN/ARRAY/FPGA31 (U6B.10), MAIN/ARRAY/FPGA31/FPGA8B (U1B#8.AK5)
FPGA_TCK_FPGA32: MAIN/ARRAY/FPGA32 (U6C.10), MAIN/ARRAY/FPGA32/FPGA8B (U1C#8.AK5)
FPGA_TCK_FPGA33: MAIN/ARRAY/FPGA33 (U6D.10), MAIN/ARRAY/FPGA33/FPGA8B (U1D#8.AK5)
FPGA_TDI_FPGA20: MAIN/ARRAY/FPGA20 (U6E.12), MAIN/ARRAY/FPGA20/FPGA8B (U1E#8.AJ5)
FPGA_TDI_FPGA21: MAIN/ARRAY/FPGA21 (U6F.12), MAIN/ARRAY/FPGA21/FPGA8B (U1F#8.AJ5)
FPGA_TDI_FPGA22: MAIN/ARRAY/FPGA22 (U6G.12), MAIN/ARRAY/FPGA22/FPGA8B (U1G#8.AJ5)
FPGA_TDI_FPGA23: MAIN/ARRAY/FPGA23 (U6H.12), MAIN/ARRAY/FPGA23/FPGA8B (U1H#8.AJ5)
FPGA_TDI_FPGA30: MAIN/ARRAY/FPGA30 (U6A.12), MAIN/ARRAY/FPGA30/FPGA8B (U1A#8.AJ5)
FPGA_TDI_FPGA31: MAIN/ARRAY/FPGA31 (U6B.12), MAIN/ARRAY/FPGA31/FPGA8B (U1B#8.AJ5)
FPGA_TDI_FPGA32: MAIN/ARRAY/FPGA32 (U6C.12), MAIN/ARRAY/FPGA32/FPGA8B (U1C#8.AJ5)
FPGA_TDI_FPGA33: MAIN/ARRAY/FPGA33 (U6D.12), MAIN/ARRAY/FPGA33/FPGA8B (U1D#8.AJ5)
FPGA_TDO_FPGA20: MAIN/ARRAY/FPGA20 (R4E.1 U6E.11), MAIN/ARRAY/FPGA20/FPGA8B (U1E#8.AG5)
FPGA_TDO_FPGA21: MAIN/ARRAY/FPGA21 (R4F.1 U6F.11), MAIN/ARRAY/FPGA21/FPGA8B (U1F#8.AG5)
FPGA_TDO_FPGA22: MAIN/ARRAY/FPGA22 (R4G.1 U6G.11), MAIN/ARRAY/FPGA22/FPGA8B (U1G#8.AG5)
FPGA_TDO_FPGA23: MAIN/ARRAY/FPGA23 (R4H.1 U6H.11), MAIN/ARRAY/FPGA23/FPGA8B (U1H#8.AG5)
FPGA_TDO_FPGA30: MAIN/ARRAY/FPGA30 (R4A.1 U6A.11), MAIN/ARRAY/FPGA30/FPGA8B (U1A#8.AG5)
FPGA_TDO_FPGA31: MAIN/ARRAY/FPGA31 (R4B.1 U6B.11), MAIN/ARRAY/FPGA31/FPGA8B (U1B#8.AG5)
FPGA_TDO_FPGA32: MAIN/ARRAY/FPGA32 (R4C.1 U6C.11), MAIN/ARRAY/FPGA32/FPGA8B (U1C#8.AG5)
FPGA_TDO_FPGA33: MAIN/ARRAY/FPGA33 (R4D.1 U6D.11), MAIN/ARRAY/FPGA33/FPGA8B (U1D#8.AG5)
FPGA_TMS_FPGA20: MAIN/ARRAY/FPGA20 (U6E.9), MAIN/ARRAY/FPGA20/FPGA8B (U1E#8.AM5)
FPGA_TMS_FPGA21: MAIN/ARRAY/FPGA21 (U6F.9), MAIN/ARRAY/FPGA21/FPGA8B (U1F#8.AM5)
FPGA_TMS_FPGA22: MAIN/ARRAY/FPGA22 (U6G.9), MAIN/ARRAY/FPGA22/FPGA8B (U1G#8.AM5)
FPGA_TMS_FPGA23: MAIN/ARRAY/FPGA23 (U6H.9), MAIN/ARRAY/FPGA23/FPGA8B (U1H#8.AM5)
FPGA_TMS_FPGA30: MAIN/ARRAY/FPGA30 (U6A.9), MAIN/ARRAY/FPGA30/FPGA8B (U1A#8.AM5)
FPGA_TMS_FPGA31: MAIN/ARRAY/FPGA31 (U6B.9), MAIN/ARRAY/FPGA31/FPGA8B (U1B#8.AM5)
FPGA_TMS_FPGA32: MAIN/ARRAY/FPGA32 (U6C.9), MAIN/ARRAY/FPGA32/FPGA8B (U1C#8.AM5)
FPGA_TMS_FPGA33: MAIN/ARRAY/FPGA33 (U6D.9), MAIN/ARRAY/FPGA33/FPGA8B (U1D#8.AM5)
I1V35_SNSB: main (NT6.A), power-v1v35 (U9.5)
I2C.SCL: MAIN/ARRAY/FPGA30/FPGAPOWER (U5A.7), MAIN/ARRAY/FPGA31/FPGAPOWER (U5B.7), MAIN/ARRAY/FPGA32/FPGAPOWER (U5C.7), MAIN/ARRAY/FPGA33/FPGAPOWER (U5D.7), MAIN/ARRAY/FPGA20/FPGAPOWER (U5E.7), MAIN/ARRAY/FPGA21/FPGAPOWER (U5F.7), MAIN/ARRAY/FPGA22/FPGAPOWER (U5G.7), MAIN/ARRAY/FPGA23/FPGAPOWER (U5H.7)
I2C.SDA: MAIN/ARRAY/FPGA30/FPGAPOWER (U5A.6), MAIN/ARRAY/FPGA31/FPGAPOWER (U5B.6), MAIN/ARRAY/FPGA32/FPGAPOWER (U5C.6), MAIN/ARRAY/FPGA33/FPGAPOWER (U5D.6), MAIN/ARRAY/FPGA20/FPGAPOWER (U5E.6), MAIN/ARRAY/FPGA21/FPGAPOWER (U5F.6), MAIN/ARRAY/FPGA22/FPGAPOWER (U5G.6), MAIN/ARRAY/FPGA23/FPGAPOWER (U5H.6)
I2V5_SNS: main (NT2.A), power-v2v5 (U23.5)
I3V3_SNS: main (NT1.A), power-v3v3 (U11.5)
I5_SNS: main (NT16.A), power-v5 (U21.5)
IL07.VIOLR_FPGA20: MAIN/ARRAY/FPGA20 (C15E.2 C16E.2 C17E.2 C18E.2), MAIN/ARRAY/FPGA20/FPGA7B (U1E#7.M10 U1E#7.P10 U1E#7.R10 U1E#7.T10)
IL07.VIOLR_FPGA21: MAIN/ARRAY/FPGA21 (C15F.2 C16F.2 C17F.2 C18F.2), MAIN/ARRAY/FPGA21/FPGA7B (U1F#7.M10 U1F#7.P10 U1F#7.R10 U1F#7.T10)
IL07.VIOLR_FPGA22: MAIN/ARRAY/FPGA22 (C15G.2 C16G.2 C17G.2 C18G.2), MAIN/ARRAY/FPGA22/FPGA7B (U1G#7.M10 U1G#7.P10 U1G#7.R10 U1G#7.T10)
IL07.VIOLR_FPGA23: MAIN/ARRAY/FPGA23 (C15H.2 C16H.2 C17H.2 C18H.2), MAIN/ARRAY/FPGA23/FPGA7B (U1H#7.M10 U1H#7.P10 U1H#7.R10 U1H#7.T10)
IL07.VIOTB_FPGA20: MAIN/ARRAY/FPGA20 (C46E.2 C47E.2 C48E.2 C49E.2), MAIN/ARRAY/FPGA20/FPGA0B (U1E#1.K12 U1E#1.K14 U1E#1.K15 U1E#1.K16)
IL07.VIOTB_FPGA21: MAIN/ARRAY/FPGA21 (C46F.2 C47F.2 C48F.2 C49F.2), MAIN/ARRAY/FPGA21/FPGA0B (U1F#1.K12 U1F#1.K14 U1F#1.K15 U1F#1.K16)
IL07.VIOTB_FPGA22: MAIN/ARRAY/FPGA22 (C46G.2 C47G.2 C48G.2 C49G.2), MAIN/ARRAY/FPGA22/FPGA0B (U1G#1.K12 U1G#1.K14 U1G#1.K15 U1G#1.K16)
IL07.VIOTB_FPGA23: MAIN/ARRAY/FPGA23 (C46H.2 C47H.2 C48H.2 C49H.2), MAIN/ARRAY/FPGA23/FPGA0B (U1H#1.K12 U1H#1.K14 U1H#1.K15 U1H#1.K16)
IL12.VIOLR_FPGA23: MAIN/ARRAY/FPGA23 (C54H.2 C55H.2 C56H.2 C57H.2), MAIN/ARRAY/FPGA23/FPGA2B (U1H#3.M23 U1H#3.P23 U1H#3.R23 U1H#3.T23)
IL12.VIOLR_FPGA33: MAIN/ARRAY/FPGA33 (C54D.2 C55D.2 C56D.2 C57D.2), MAIN/ARRAY/FPGA33/FPGA2B (U1D#3.M23 U1D#3.P23 U1D#3.R23 U1D#3.T23)
IL12.VIOTB_FPGA23: MAIN/ARRAY/FPGA23 (C50H.2 C51H.2 C52H.2 C53H.2), MAIN/ARRAY/FPGA23/FPGA1B (U1H#2.K17 U1H#2.K18 U1H#2.K19 U1H#2.K21)
IL12.VIOTB_FPGA33: MAIN/ARRAY/FPGA33 (C50D.2 C51D.2 C52D.2 C53D.2), MAIN/ARRAY/FPGA33/FPGA1B (U1D#2.K17 U1D#2.K18 U1D#2.K19 U1D#2.K21)
IL34.VIOLR_FPGA30: MAIN/ARRAY/FPGA30 (C22A.2 C23A.2 C24A.2 C25A.2), MAIN/ARRAY/FPGA30/FPGA3B (U1A#4.AA23 U1A#4.U23 U1A#4.V23 U1A#4.W23)
IL34.VIOLR_FPGA31: MAIN/ARRAY/FPGA31 (C22B.2 C23B.2 C24B.2 C25B.2), MAIN/ARRAY/FPGA31/FPGA3B (U1B#4.AA23 U1B#4.U23 U1B#4.V23 U1B#4.W23)
IL34.VIOLR_FPGA32: MAIN/ARRAY/FPGA32 (C22C.2 C23C.2 C24C.2 C25C.2), MAIN/ARRAY/FPGA32/FPGA3B (U1C#4.AA23 U1C#4.U23 U1C#4.V23 U1C#4.W23)
IL34.VIOLR_FPGA33: MAIN/ARRAY/FPGA33 (C22D.2 C23D.2 C24D.2 C25D.2), MAIN/ARRAY/FPGA33/FPGA3B (U1D#4.AA23 U1D#4.U23 U1D#4.V23 U1D#4.W23)
IL34.VIOTB_FPGA30: MAIN/ARRAY/FPGA30 (C28A.2 C29A.2 C30A.2), MAIN/ARRAY/FPGA30/FPGA4B (U1A#5.AB23 U1A#5.AC23)
IL34.VIOTB_FPGA31: MAIN/ARRAY/FPGA31 (C28B.2 C29B.2 C30B.2), MAIN/ARRAY/FPGA31/FPGA4B (U1B#5.AB23 U1B#5.AC23)
IL34.VIOTB_FPGA32: MAIN/ARRAY/FPGA32 (C28C.2 C29C.2 C30C.2), MAIN/ARRAY/FPGA32/FPGA4B (U1C#5.AB23 U1C#5.AC23)
IL34.VIOTB_FPGA33: MAIN/ARRAY/FPGA33 (C28D.2 C29D.2 C30D.2), MAIN/ARRAY/FPGA33/FPGA4B (U1D#5.AB23 U1D#5.AC23)
IL68.VIOLR_FPGA20: MAIN/ARRAY/FPGA20 (C33E.2 C34E.2 C35E.2 C36E.2), MAIN/ARRAY/FPGA20/FPGA6B (U1E#6.AA10 U1E#6.U10 U1E#6.V10 U1E#6.W10)
IL68.VIOLR_FPGA30: MAIN/ARRAY/FPGA30 (C33A.2 C34A.2 C35A.2 C36A.2), MAIN/ARRAY/FPGA30/FPGA6B (U1A#6.AA10 U1A#6.U10 U1A#6.V10 U1A#6.W10)
IL68.VIOTB_FPGA20: MAIN/ARRAY/FPGA20 (C31E.2 C32E.2 R4E.2 U6E.13), MAIN/ARRAY/FPGA20/FPGA8B (R1E.2 U1E#8.AB10 U1E#8.AC10)
IL68.VIOTB_FPGA30: MAIN/ARRAY/FPGA30 (C31A.2 C32A.2 R4A.2 U6A.13), MAIN/ARRAY/FPGA30/FPGA8B (R1A.2 U1A#8.AB10 U1A#8.AC10)
ILPR.VIOB: MAIN/ARRAY/SDRAM33/SDRAMU (31 pins), MAIN/ARRAY/SDRAM33/SDRAML (31 pins), MAIN/ARRAY/SDRAM32/SDRAMU (31 pins), MAIN/ARRAY/SDRAM32/SDRAML (31 pins), MAIN/ARRAY/SDRAM31/SDRAMU (31 pins), MAIN/ARRAY/SDRAM31/SDRAML (31 pins), MAIN/ARRAY/SDRAM30/SDRAMU (31 pins), MAIN/ARRAY/SDRAM30/SDRAML (31 pins)
ILPR.VTTA: MAIN/ARRAY/SDRAM33 (6 pins), MAIN/ARRAY/SDRAM32 (6 pins), MAIN/ARRAY/SDRAM31 (6 pins), MAIN/ARRAY/SDRAM30 (6 pins)
ILPR.VTTB: MAIN/ARRAY/SDRAM33 (25 pins), MAIN/ARRAY/SDRAM33/SDRAMU (5 pins), MAIN/ARRAY/SDRAM33/SDRAML (5 pins), MAIN/ARRAY/SDRAM32 (25 pins), MAIN/ARRAY/SDRAM32/SDRAMU (5 pins), MAIN/ARRAY/SDRAM32/SDRAML (5 pins), MAIN/ARRAY/SDRAM31 (25 pins), MAIN/ARRAY/SDRAM31/SDRAMU (5 pins), MAIN/ARRAY/SDRAM31/SDRAML (5 pins), MAIN/ARRAY/SDRAM30 (25 pins), MAIN/ARRAY/SDRAM30/SDRAMU (5 pins), MAIN/ARRAY/SDRAM30/SDRAML (5 pins)
IMIB.S0: MAIN/ARRAY/FPGA20/FPGA0B (U1E#1.A10), MAIN/ARRAY/FPGA21/FPGA0B (U1F#1.A10), MAIN/ARRAY/FPGA22/FPGA0B (U1G#1.A10), MAIN/ARRAY/FPGA23/FPGA0B (U1H#1.A10)
IMIB.S1: MAIN/ARRAY/FPGA20/FPGA0B (U1E#1.B10), MAIN/ARRAY/FPGA21/FPGA0B (U1F#1.B10), MAIN/ARRAY/FPGA22/FPGA0B (U1G#1.B10), MAIN/ARRAY/FPGA23/FPGA0B (U1H#1.B10)
IMIB.S2: MAIN/ARRAY/FPGA20/FPGA0B (U1E#1.E11), MAIN/ARRAY/FPGA21/FPGA0B (U1F#1.E11), MAIN/ARRAY/FPGA22/FPGA0B (U1G#1.E11), MAIN/ARRAY/FPGA23/FPGA0B (U1H#1.E11)
IMIB.S3: MAIN/ARRAY/FPGA20/FPGA0B (U1E#1.F11), MAIN/ARRAY/FPGA21/FPGA0B (U1F#1.F11), MAIN/ARRAY/FPGA22/FPGA0B (U1G#1.F11), MAIN/ARRAY/FPGA23/FPGA0B (U1H#1.F11)
IMIB.S4: MAIN/ARRAY/FPGA20/FPGA0B (U1E#1.E10), MAIN/ARRAY/FPGA21/FPGA0B (U1F#1.E10), MAIN/ARRAY/FPGA22/FPGA0B (U1G#1.E10), MAIN/ARRAY/FPGA23/FPGA0B (U1H#1.E10)
IMIB.S5: MAIN/ARRAY/FPGA20/FPGA0B (U1E#1.F10), MAIN/ARRAY/FPGA21/FPGA0B (U1F#1.F10), MAIN/ARRAY/FPGA22/FPGA0B (U1G#1.F10), MAIN/ARRAY/FPGA23/FPGA0B (U1H#1.F10)
IMIB.S6: MAIN/ARRAY/FPGA20/FPGA0B (U1E#1.A11), MAIN/ARRAY/FPGA21/FPGA0B (U1F#1.A11), MAIN/ARRAY/FPGA22/FPGA0B (U1G#1.A11), MAIN/ARRAY/FPGA23/FPGA0B (U1H#1.A11)
IMIB.S7: MAIN/ARRAY/FPGA20/FPGA0B (U1E#1.B11), MAIN/ARRAY/FPGA21/FPGA0B (U1F#1.B11), MAIN/ARRAY/FPGA22/FPGA0B (U1G#1.B11), MAIN/ARRAY/FPGA23/FPGA0B (U1H#1.B11)
IMIB.S8: MAIN/ARRAY/FPGA20/FPGA0B (U1E#1.D13), MAIN/ARRAY/FPGA21/FPGA0B (U1F#1.D13), MAIN/ARRAY/FPGA22/FPGA0B (U1G#1.D13), MAIN/ARRAY/FPGA23/FPGA0B (U1H#1.D13)
IMIB.S9: MAIN/ARRAY/FPGA20/FPGA0B (U1E#1.F13), MAIN/ARRAY/FPGA21/FPGA0B (U1F#1.F13), MAIN/ARRAY/FPGA22/FPGA0B (U1G#1.F13), MAIN/ARRAY/FPGA23/FPGA0B (U1H#1.F13)
IMIB.S10: MAIN/ARRAY/FPGA20/FPGA0B (U1E#1.A13), MAIN/ARRAY/FPGA21/FPGA0B (U1F#1.A13), MAIN/ARRAY/FPGA22/FPGA0B (U1G#1.A13), MAIN/ARRAY/FPGA23/FPGA0B (U1H#1.A13)
IMIB.S11: MAIN/ARRAY/FPGA20/FPGA0B (U1E#1.C13), MAIN/ARRAY/FPGA21/FPGA0B (U1F#1.C13), MAIN/ARRAY/FPGA22/FPGA0B (U1G#1.C13), MAIN/ARRAY/FPGA23/FPGA0B (U1H#1.C13)
IMIB.S12: MAIN/ARRAY/FPGA20/FPGA0B (U1E#1.E14), MAIN/ARRAY/FPGA21/FPGA0B (U1F#1.E14), MAIN/ARRAY/FPGA22/FPGA0B (U1G#1.E14), MAIN/ARRAY/FPGA23/FPGA0B (U1H#1.E14)
IMIB.S13: MAIN/ARRAY/FPGA20/FPGA0B (U1E#1.F14), MAIN/ARRAY/FPGA21/FPGA0B (U1F#1.F14), MAIN/ARRAY/FPGA22/FPGA0B (U1G#1.F14), MAIN/ARRAY/FPGA23/FPGA0B (U1H#1.F14)
IMIB.S14: MAIN/ARRAY/FPGA20/FPGA0B (U1E#1.C14), MAIN/ARRAY/FPGA21/FPGA0B (U1F#1.C14), MAIN/ARRAY/FPGA22/FPGA0B (U1G#1.C14), MAIN/ARRAY/FPGA23/FPGA0B (U1H#1.C14)
IMIB.S15: MAIN/ARRAY/FPGA20/FPGA0B (U1E#1.D14), MAIN/ARRAY/FPGA21/FPGA0B (U1F#1.D14), MAIN/ARRAY/FPGA22/FPGA0B (U1G#1.D14), MAIN/ARRAY/FPGA23/FPGA0B (U1H#1.D14)
IMIB.S16: MAIN/ARRAY/FPGA20/FPGA0B (U1E#1.A14), MAIN/ARRAY/FPGA21/FPGA0B (U1F#1.A14), MAIN/ARRAY/FPGA22/FPGA0B (U1G#1.A14), MAIN/ARRAY/FPGA23/FPGA0B (U1H#1.A14)
IMIB.S17: MAIN/ARRAY/FPGA20/FPGA0B (U1E#1.B14), MAIN/ARRAY/FPGA21/FPGA0B (U1F#1.B14), MAIN/ARRAY/FPGA22/FPGA0B (U1G#1.B14), MAIN/ARRAY/FPGA23/FPGA0B (U1H#1.B14)
IMIB.S18: MAIN/ARRAY/FPGA20/FPGA0B (U1E#1.D15), MAIN/ARRAY/FPGA21/FPGA0B (U1F#1.D15), MAIN/ARRAY/FPGA22/FPGA0B (U1G#1.D15), MAIN/ARRAY/FPGA23/FPGA0B (U1H#1.D15)
IMIB.S19: MAIN/ARRAY/FPGA20/FPGA0B (U1E#1.F15), MAIN/ARRAY/FPGA21/FPGA0B (U1F#1.F15), MAIN/ARRAY/FPGA22/FPGA0B (U1G#1.F15), MAIN/ARRAY/FPGA23/FPGA0B (U1H#1.F15)
IMIB.S20: MAIN/ARRAY/FPGA20/FPGA0B (U1E#1.A15), MAIN/ARRAY/FPGA21/FPGA0B (U1F#1.A15), MAIN/ARRAY/FPGA22/FPGA0B (U1G#1.A15), MAIN/ARRAY/FPGA23/FPGA0B (U1H#1.A15)
IMIB.S21: MAIN/ARRAY/FPGA20/FPGA0B (U1E#1.C15), MAIN/ARRAY/FPGA21/FPGA0B (U1F#1.C15), MAIN/ARRAY/FPGA22/FPGA0B (U1G#1.C15), MAIN/ARRAY/FPGA23/FPGA0B (U1H#1.C15)
IMIB.S22: MAIN/ARRAY/FPGA20/FPGA0B (U1E#1.E16), MAIN/ARRAY/FPGA21/FPGA0B (U1F#1.E16), MAIN/ARRAY/FPGA22/FPGA0B (U1G#1.E16), MAIN/ARRAY/FPGA23/FPGA0B (U1H#1.E16)
IMIB.S23: MAIN/ARRAY/FPGA20/FPGA0B (U1E#1.F16), MAIN/ARRAY/FPGA21/FPGA0B (U1F#1.F16), MAIN/ARRAY/FPGA22/FPGA0B (U1G#1.F16), MAIN/ARRAY/FPGA23/FPGA0B (U1H#1.F16)
IMIB.S24: MAIN/ARRAY/FPGA20/FPGA0B (U1E#1.C16), MAIN/ARRAY/FPGA21/FPGA0B (U1F#1.C16), MAIN/ARRAY/FPGA22/FPGA0B (U1G#1.C16), MAIN/ARRAY/FPGA23/FPGA0B (U1H#1.C16)
IMIB.S25: MAIN/ARRAY/FPGA20/FPGA0B (U1E#1.D16), MAIN/ARRAY/FPGA21/FPGA0B (U1F#1.D16), MAIN/ARRAY/FPGA22/FPGA0B (U1G#1.D16), MAIN/ARRAY/FPGA23/FPGA0B (U1H#1.D16)
IMIB.S26: MAIN/ARRAY/FPGA20/FPGA0B (U1E#1.A16), MAIN/ARRAY/FPGA21/FPGA0B (U1F#1.A16), MAIN/ARRAY/FPGA22/FPGA0B (U1G#1.A16), MAIN/ARRAY/FPGA23/FPGA0B (U1H#1.A16)
IMIB.S27: MAIN/ARRAY/FPGA20/FPGA0B (U1E#1.B16), MAIN/ARRAY/FPGA21/FPGA0B (U1F#1.B16), MAIN/ARRAY/FPGA22/FPGA0B (U1G#1.B16), MAIN/ARRAY/FPGA23/FPGA0B (U1H#1.B16)
IMIB.S28: MAIN/ARRAY/FPGA20/FPGA0B (U1E#1.B17), MAIN/ARRAY/FPGA21/FPGA0B (U1F#1.B17), MAIN/ARRAY/FPGA22/FPGA0B (U1G#1.B17), MAIN/ARRAY/FPGA23/FPGA0B (U1H#1.B17)
IMIB.S29: MAIN/ARRAY/FPGA20/FPGA0B (U1E#1.A17), MAIN/ARRAY/FPGA21/FPGA0B (U1F#1.A17), MAIN/ARRAY/FPGA22/FPGA0B (U1G#1.A17), MAIN/ARRAY/FPGA23/FPGA0B (U1H#1.A17)
IN: tx (T7.3), MAIN/U_radio/U_radio-rf/TX/U_pa-5g (C112A.1)
IN: tx (T9.3), MAIN/U_radio/U_radio-rf/TX/U_pa-5g (C112B.1)
IN: tx (U19.4), MAIN/U_radio/U_radio-rf/TX/U_pa-2g (U2A.1 U2A.2)
IN: tx (U20.4), MAIN/U_radio/U_radio-rf/TX/U_pa-2g (U2B.1 U2B.2)
MIB.S0: MAIN/ARRAY/FPGA30/FPGA0B (U1A#1.A10), MAIN/ARRAY/FPGA31/FPGA0B (U1B#1.A10), MAIN/ARRAY/FPGA32/FPGA0B (U1C#1.A10), MAIN/ARRAY/FPGA33/FPGA0B (U1D#1.A10)
MIB.S1: MAIN/ARRAY/FPGA30/FPGA0B (U1A#1.B10), MAIN/ARRAY/FPGA31/FPGA0B (U1B#1.B10), MAIN/ARRAY/FPGA32/FPGA0B (U1C#1.B10), MAIN/ARRAY/FPGA33/FPGA0B (U1D#1.B10)
MIB.S2: MAIN/ARRAY/FPGA30/FPGA0B (U1A#1.E11), MAIN/ARRAY/FPGA31/FPGA0B (U1B#1.E11), MAIN/ARRAY/FPGA32/FPGA0B (U1C#1.E11), MAIN/ARRAY/FPGA33/FPGA0B (U1D#1.E11)
MIB.S3: MAIN/ARRAY/FPGA30/FPGA0B (U1A#1.F11), MAIN/ARRAY/FPGA31/FPGA0B (U1B#1.F11), MAIN/ARRAY/FPGA32/FPGA0B (U1C#1.F11), MAIN/ARRAY/FPGA33/FPGA0B (U1D#1.F11)
MIB.S4: MAIN/ARRAY/FPGA30/FPGA0B (U1A#1.E10), MAIN/ARRAY/FPGA31/FPGA0B (U1B#1.E10), MAIN/ARRAY/FPGA32/FPGA0B (U1C#1.E10), MAIN/ARRAY/FPGA33/FPGA0B (U1D#1.E10)
MIB.S5: MAIN/ARRAY/FPGA30/FPGA0B (U1A#1.F10), MAIN/ARRAY/FPGA31/FPGA0B (U1B#1.F10), MAIN/ARRAY/FPGA32/FPGA0B (U1C#1.F10), MAIN/ARRAY/FPGA33/FPGA0B (U1D#1.F10)
MIB.S6: MAIN/ARRAY/FPGA30/FPGA0B (U1A#1.A11), MAIN/ARRAY/FPGA31/FPGA0B (U1B#1.A11), MAIN/ARRAY/FPGA32/FPGA0B (U1C#1.A11), MAIN/ARRAY/FPGA33/FPGA0B (U1D#1.A11)
MIB.S7: MAIN/ARRAY/FPGA30/FPGA0B (U1A#1.B11), MAIN/ARRAY/FPGA31/FPGA0B (U1B#1.B11), MAIN/ARRAY/FPGA32/FPGA0B (U1C#1.B11), MAIN/ARRAY/FPGA33/FPGA0B (U1D#1.B11)
MIB.S8: MAIN/ARRAY/FPGA30/FPGA0B (U1A#1.D13), MAIN/ARRAY/FPGA31/FPGA0B (U1B#1.D13), MAIN/ARRAY/FPGA32/FPGA0B (U1C#1.D13), MAIN/ARRAY/FPGA33/FPGA0B (U1D#1.D13)
MIB.S9: MAIN/ARRAY/FPGA30/FPGA0B (U1A#1.F13), MAIN/ARRAY/FPGA31/FPGA0B (U1B#1.F13), MAIN/ARRAY/FPGA32/FPGA0B (U1C#1.F13), MAIN/ARRAY/FPGA33/FPGA0B (U1D#1.F13)
MIB.S10: MAIN/ARRAY/FPGA30/FPGA0B (U1A#1.A13), MAIN/ARRAY/FPGA31/FPGA0B (U1B#1.A13), MAIN/ARRAY/FPGA32/FPGA0B (U1C#1.A13), MAIN/ARRAY/FPGA33/FPGA0B (U1D#1.A13)
MIB.S11: MAIN/ARRAY/FPGA30/FPGA0B (U1A#1.C13), MAIN/ARRAY/FPGA31/FPGA0B (U1B#1.C13), MAIN/ARRAY/FPGA32/FPGA0B (U1C#1.C13), MAIN/ARRAY/FPGA33/FPGA0B (U1D#1.C13)
MIB.S12: MAIN/ARRAY/FPGA30/FPGA0B (U1A#1.E14), MAIN/ARRAY/FPGA31/FPGA0B (U1B#1.E14), MAIN/ARRAY/FPGA32/FPGA0B (U1C#1.E14), MAIN/ARRAY/FPGA33/FPGA0B (U1D#1.E14)
MIB.S13: MAIN/ARRAY/FPGA30/FPGA0B (U1A#1.F14), MAIN/ARRAY/FPGA31/FPGA0B (U1B#1.F14), MAIN/ARRAY/FPGA32/FPGA0B (U1C#1.F14), MAIN/ARRAY/FPGA33/FPGA0B (U1D#1.F14)
MIB.S14: MAIN/ARRAY/FPGA30/FPGA0B (U1A#1.C14), MAIN/ARRAY/FPGA31/FPGA0B (U1B#1.C14), MAIN/ARRAY/FPGA32/FPGA0B (U1C#1.C14), MAIN/ARRAY/FPGA33/FPGA0B (U1D#1.C14)
MIB.S15: MAIN/ARRAY/FPGA30/FPGA0B (U1A#1.D14), MAIN/ARRAY/FPGA31/FPGA0B (U1B#1.D14), MAIN/ARRAY/FPGA32/FPGA0B (U1C#1.D14), MAIN/ARRAY/FPGA33/FPGA0B (U1D#1.D14)
MIB.S16: MAIN/ARRAY/FPGA30/FPGA0B (U1A#1.A14), MAIN/ARRAY/FPGA31/FPGA0B (U1B#1.A14), MAIN/ARRAY/FPGA32/FPGA0B (U1C#1.A14), MAIN/ARRAY/FPGA33/FPGA0B (U1D#1.A14)
MIB.S17: MAIN/ARRAY/FPGA30/FPGA0B (U1A#1.B14), MAIN/ARRAY/FPGA31/FPGA0B (U1B#1.B14), MAIN/ARRAY/FPGA32/FPGA0B (U1C#1.B14), MAIN/ARRAY/FPGA33/FPGA0B (U1D#1.B14)
MIB.S18: MAIN/ARRAY/FPGA30/FPGA0B (U1A#1.D15), MAIN/ARRAY/FPGA31/FPGA0B (U1B#1.D15), MAIN/ARRAY/FPGA32/FPGA0B (U1C#1.D15), MAIN/ARRAY/FPGA33/FPGA0B (U1D#1.D15)
MIB.S19: MAIN/ARRAY/FPGA30/FPGA0B (U1A#1.F15), MAIN/ARRAY/FPGA31/FPGA0B (U1B#1.F15), MAIN/ARRAY/FPGA32/FPGA0B (U1C#1.F15), MAIN/ARRAY/FPGA33/FPGA0B (U1D#1.F15)
MIB.S20: MAIN/ARRAY/FPGA30/FPGA0B (U1A#1.A15), MAIN/ARRAY/FPGA31/FPGA0B (U1B#1.A15), MAIN/ARRAY/FPGA32/FPGA0B (U1C#1.A15), MAIN/ARRAY/FPGA33/FPGA0B (U1D#1.A15)
MIB.S21: MAIN/ARRAY/FPGA30/FPGA0B (U1A#1.C15), MAIN/ARRAY/FPGA31/FPGA0B (U1B#1.C15), MAIN/ARRAY/FPGA32/FPGA0B (U1C#1.C15), MAIN/ARRAY/FPGA33/FPGA0B (U1D#1.C15)
MIB.S22: MAIN/ARRAY/FPGA30/FPGA0B (U1A#1.E16), MAIN/ARRAY/FPGA31/FPGA0B (U1B#1.E16), MAIN/ARRAY/FPGA32/FPGA0B (U1C#1.E16), MAIN/ARRAY/FPGA33/FPGA0B (U1D#1.E16)
MIB.S23: MAIN/ARRAY/FPGA30/FPGA0B (U1A#1.F16), MAIN/ARRAY/FPGA31/FPGA0B (U1B#1.F16), MAIN/ARRAY/FPGA32/FPGA0B (U1C#1.F16), MAIN/ARRAY/FPGA33/FPGA0B (U1D#1.F16)
MIB.S24: MAIN/ARRAY/FPGA30/FPGA0B (U1A#1.C16), MAIN/ARRAY/FPGA31/FPGA0B (U1B#1.C16), MAIN/ARRAY/FPGA32/FPGA0B (U1C#1.C16), MAIN/ARRAY/FPGA33/FPGA0B (U1D#1.C16)
MIB.S25: MAIN/ARRAY/FPGA30/FPGA0B (U1A#1.D16), MAIN/ARRAY/FPGA31/FPGA0B (U1B#1.D16), MAIN/ARRAY/FPGA32/FPGA0B (U1C#1.D16), MAIN/ARRAY/FPGA33/FPGA0B (U1D#1.D16)
MIB.S26: MAIN/ARRAY/FPGA30/FPGA0B (U1A#1.A16), MAIN/ARRAY/FPGA31/FPGA0B (U1B#1.A16), MAIN/ARRAY/FPGA32/FPGA0B (U1C#1.A16), MAIN/ARRAY/FPGA33/FPGA0B (U1D#1.A16)
MIB.S27: MAIN/ARRAY/FPGA30/FPGA0B (U1A#1.B16), MAIN/ARRAY/FPGA31/FPGA0B (U1B#1.B16), MAIN/ARRAY/FPGA32/FPGA0B (U1C#1.B16), MAIN/ARRAY/FPGA33/FPGA0B (U1D#1.B16)
MIB.S28: MAIN/ARRAY/FPGA30/FPGA0B (U1A#1.B17), MAIN/ARRAY/FPGA31/FPGA0B (U1B#1.B17), MAIN/ARRAY/FPGA32/FPGA0B (U1C#1.B17), MAIN/ARRAY/FPGA33/FPGA0B (U1D#1.B17)
MIB.S29: MAIN/ARRAY/FPGA30/FPGA0B (U1A#1.A17), MAIN/ARRAY/FPGA31/FPGA0B (U1B#1.A17), MAIN/ARRAY/FPGA32/FPGA0B (U1C#1.A17), MAIN/ARRAY/FPGA33/FPGA0B (U1D#1.A17)
NetC153_1: radio-rf (U18.M2), rx (C153.1)
NetC154_1: radio-rf (U18.M1), rx (C154.1)
NetC155_1: radio-rf (U18.J1), rx (C155.1)
NetC156_1: radio-rf (U18.H1), rx (C156.1)
NetC157_1: radio-rf (U18.L1), rx (C157.1)
NetC169_1: radio-rf (U18.K1), rx (C169.1)
NetC170_1: radio-rf (U18.A1), rx (C170.1)
NetC171_1: radio-rf (U18.A2), rx (C171.1)
NetC172_1: radio-rf (U18.F1), rx (C172.1)
NetC173_1: radio-rf (U18.E1), rx (C173.1)
NetC174_1: radio-rf (U18.D1), rx (C174.1)
NetC175_1: radio-rf (U18.C1), rx (C175.1)
OUT: tx (P7.1), MAIN/U_radio/U_radio-rf/TX/U_pa-5g (C113A.2 C114A.2)
OUT: tx (P8.1), MAIN/U_radio/U_radio-rf/TX/U_pa-2g (C106A.1 L6A.2)
OUT: tx (P10.1), MAIN/U_radio/U_radio-rf/TX/U_pa-5g (C113B.2 C114B.2)
OUT: tx (P11.1), MAIN/U_radio/U_radio-rf/TX/U_pa-2g (C106B.1 L6B.2)
V2V5_SNS: main (NT3.A), power-v2v5 (C168.2 R112.1 R114.2)